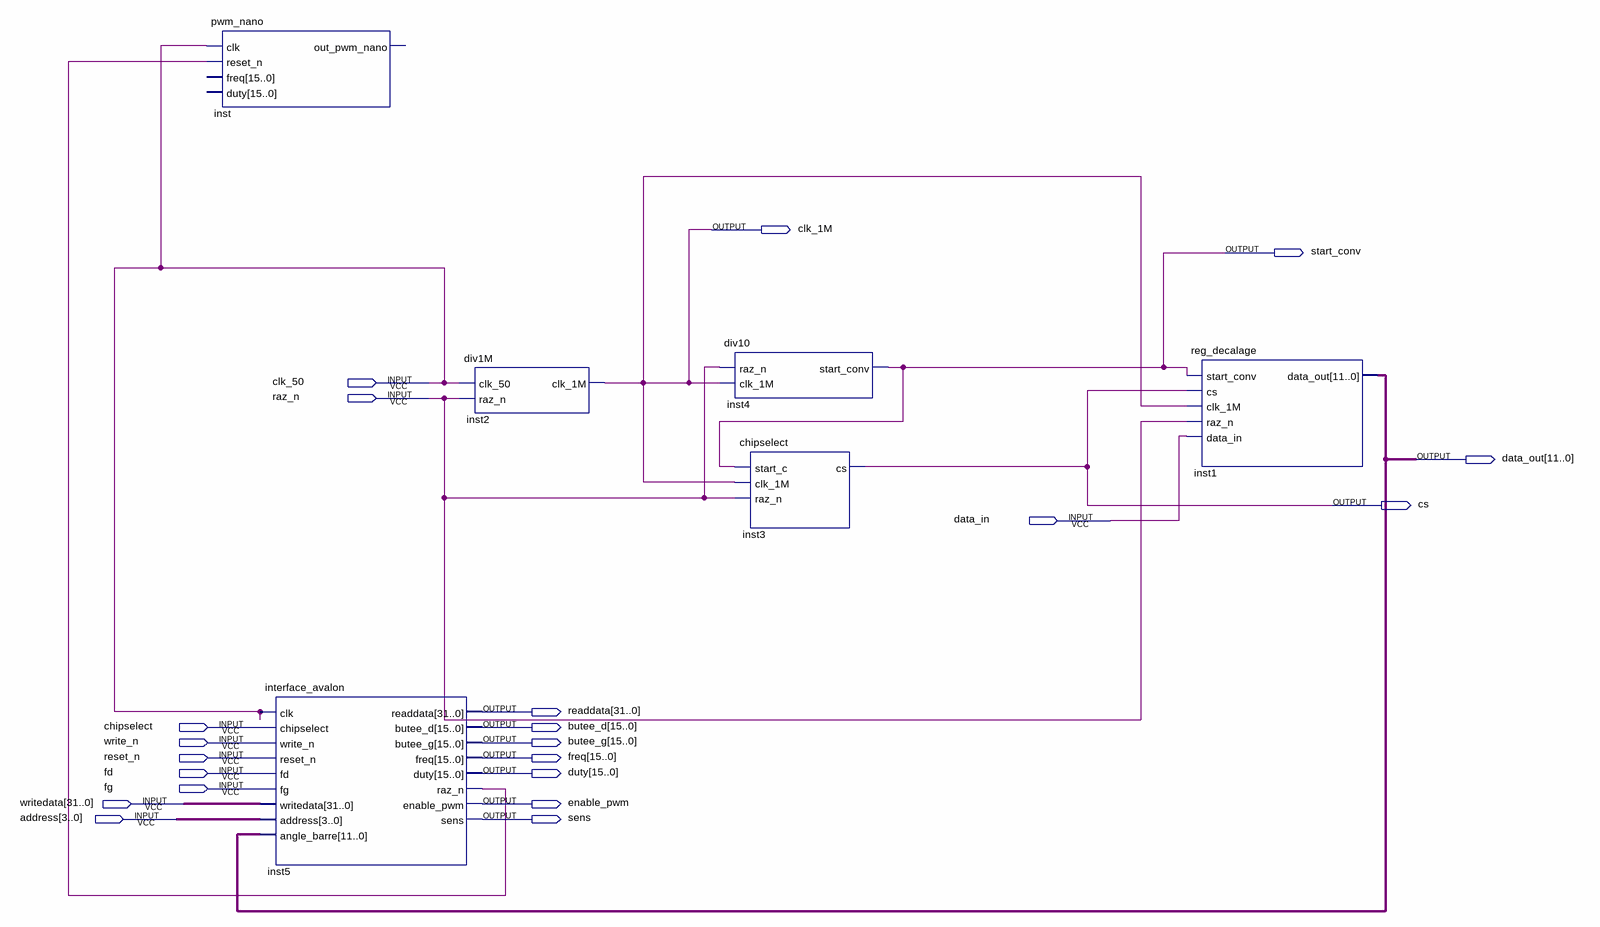
[diagram p0: schematic sheet]
// Quartus schematic mcp.bdf as structural Verilog: 6 symbols, 21 pins
module mcp (
  input  clk_50,
  input  raz_n,
  input  data_in,
  input  chipselect,
  input  write_n,
  input  reset_n,
  input  fd,
  input  fg,
  input  [31:0] writedata,
  input  [3:0] address,
  output clk_1M,
  output start_conv,
  output [11:0] data_out,
  output cs,
  output [31:0] readdata,
  output [15:0] butee_d,
  output [15:0] butee_g,
  output [15:0] freq,
  output [15:0] duty,
  output enable_pwm,
  output sens
);

  wire inst5_raz_n;

  pwm_nano inst (.clk(clk_50), .reset_n(inst5_raz_n));  // open: freq, duty, out_pwm_nano
  interface_avalon inst5 (
    .clk(clk_50), .chipselect(chipselect), .write_n(write_n), .reset_n(reset_n), .fd(fd), .fg(fg),
    .writedata(writedata), .address(address), .angle_barre(data_out), .readdata(readdata), .butee_d(butee_d),
    .butee_g(butee_g), .freq(freq), .duty(duty), .raz_n(inst5_raz_n), .enable_pwm(enable_pwm), .sens(sens));
  div1M inst2 (.clk_50(clk_50), .raz_n(raz_n), .clk_1M(clk_1M));
  div10 inst4 (.raz_n(raz_n), .clk_1M(clk_1M), .start_conv(start_conv));
  chipselect inst3 (.start_c(start_conv), .clk_1M(clk_1M), .raz_n(raz_n), .cs(cs));
  reg_decalage inst1 (
    .start_conv(start_conv), .cs(cs), .clk_1M(clk_1M), .raz_n(raz_n), .data_in(data_in), .data_out(data_out));
endmodule
